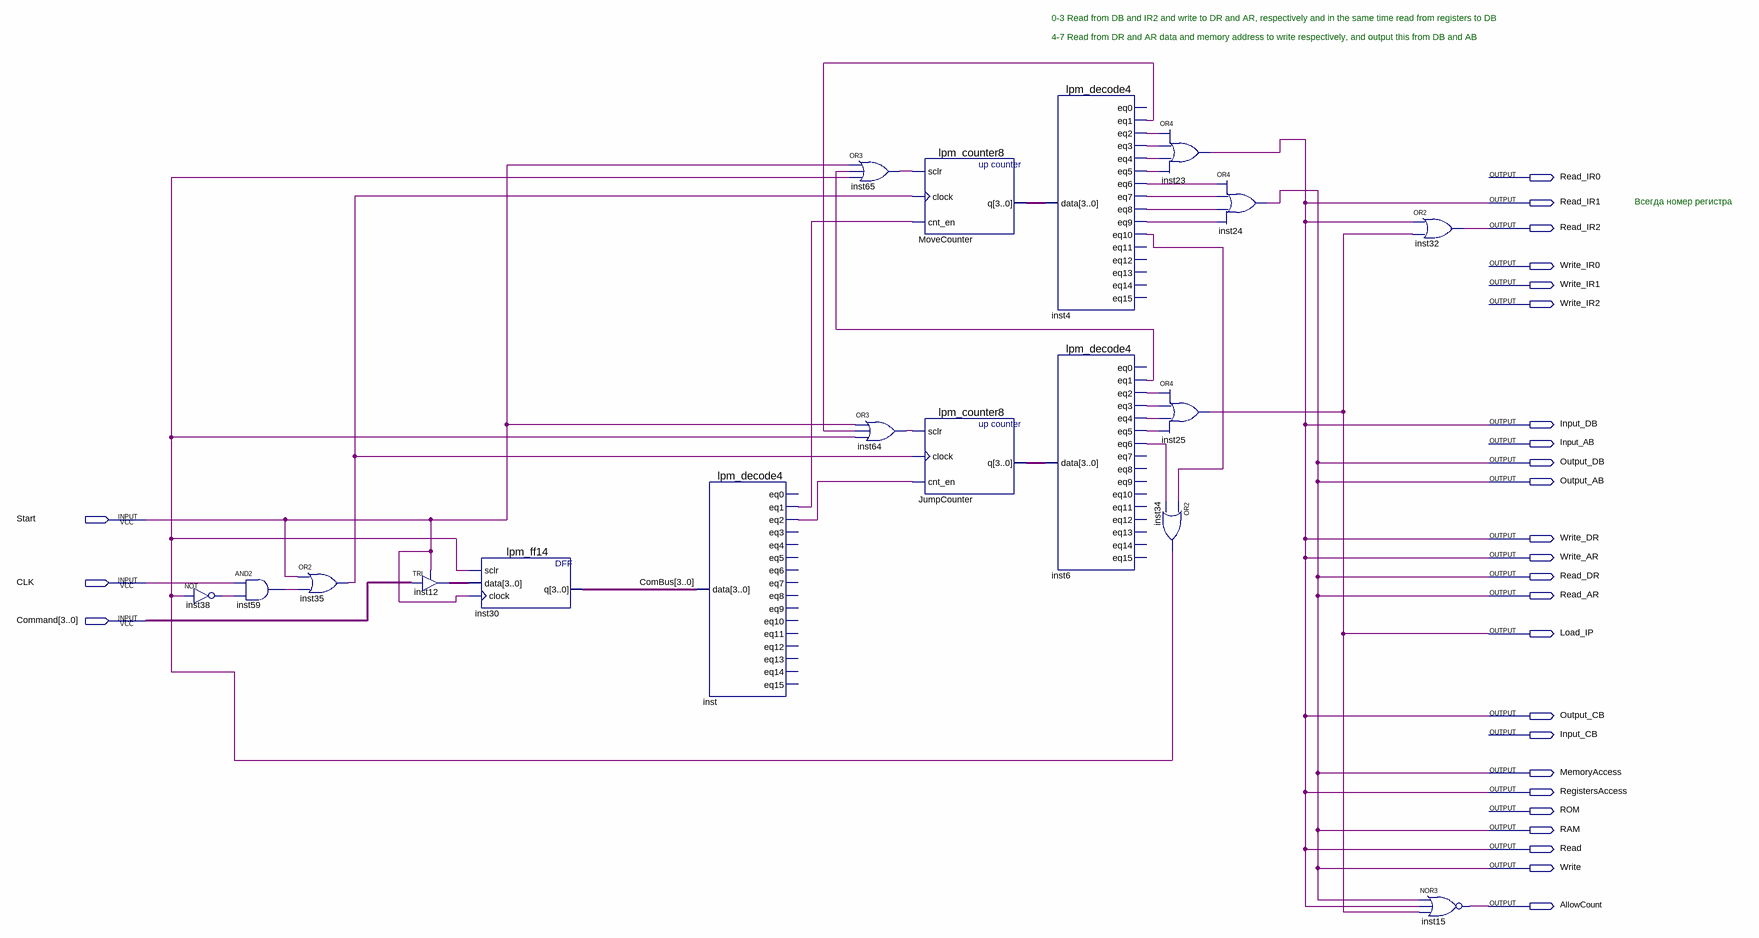
[diagram p0: schematic sheet]
// Quartus schematic CommandControl.bdf as structural Verilog: 18 symbols, 27 pins
module CommandControl (
  input  Start,
  input  CLK,
  input  [3:0] Command,
  output Read_IR0,
  output Read_IR1,
  output Read_IR2,
  output Write_IR0,
  output Write_IR1,
  output Write_IR2,
  output Input_DB,
  output Input_AB,
  output Output_DB,
  output Output_AB,
  output Write_DR,
  output Write_AR,
  output Read_DR,
  output Read_AR,
  output Load_IP,
  output Output_CB,
  output Input_CB,
  output MemoryAccess,
  output RegistersAccess,
  output ROM,
  output RAM,
  output Read,
  output Write,
  output AllowCount
);

  wire inst4_eq1, inst4_eq2, inst4_eq3, inst4_eq4, inst4_eq5, inst4_eq6, inst4_eq7, inst4_eq8, inst4_eq9,
       inst4_eq10, inst6_eq1, inst6_eq2, inst6_eq3, inst6_eq4, inst6_eq5, inst6_eq6, inst34_out, inst35_out,
       inst38_out, inst59_out, inst64_out, inst65_out, inst_eq1, inst_eq2;
  wire [3:0] ComBus, inst12_out, JumpCounter_q, MoveCounter_q;

  not inst38 (inst38_out, inst34_out);
  and inst59 (inst59_out, CLK, inst38_out);
  or inst35 (inst35_out, Start, inst59_out);
  TRI inst12[3:0] (.IN(Command), .OE(Start), .OUT(inst12_out));
  lpm_ff14 inst30 (.sclr(inst34_out), .data(inst12_out), .clock(Start), .q(ComBus));
  lpm_decode4 inst (
    .data(ComBus), .eq1(inst_eq1), .eq2(inst_eq2));  // open: eq0, eq3, eq4, eq5, eq6, eq7, eq8, eq9, eq10, eq11, eq12, eq13, eq14, eq15
  or inst65 (inst65_out, Start, inst6_eq1, inst34_out);
  or inst64 (inst64_out, Start, inst4_eq1, inst34_out);
  lpm_counter8 MoveCounter (.sclr(inst65_out), .clock(inst35_out), .cnt_en(inst_eq1), .q(MoveCounter_q));
  lpm_counter8 JumpCounter (.sclr(inst64_out), .clock(inst35_out), .cnt_en(inst_eq2), .q(JumpCounter_q));
  lpm_decode4 inst4 (
    .data(MoveCounter_q), .eq1(inst4_eq1), .eq2(inst4_eq2), .eq3(inst4_eq3), .eq4(inst4_eq4),
    .eq5(inst4_eq5), .eq6(inst4_eq6), .eq7(inst4_eq7), .eq8(inst4_eq8), .eq9(inst4_eq9), .eq10(inst4_eq10));  // open: eq0, eq11, eq12, eq13, eq14, eq15
  lpm_decode4 inst6 (
    .data(JumpCounter_q), .eq1(inst6_eq1), .eq2(inst6_eq2), .eq3(inst6_eq3), .eq4(inst6_eq4),
    .eq5(inst6_eq5), .eq6(inst6_eq6));  // open: eq0, eq7, eq8, eq9, eq10, eq11, eq12, eq13, eq14, eq15
  or inst23 (Input_DB, inst4_eq2, inst4_eq3, inst4_eq4, inst4_eq5);
  or inst25 (Load_IP, inst6_eq2, inst6_eq3, inst6_eq4, inst6_eq5);
  or inst34 (inst34_out, inst4_eq10, inst6_eq6);
  or inst24 (MemoryAccess, inst4_eq6, inst4_eq7, inst4_eq8, inst4_eq9);
  or inst32 (Read_IR2, Input_DB, Load_IP);
  nor inst15 (AllowCount, MemoryAccess, Input_DB, Load_IP);

  assign Output_AB = MemoryAccess;
  assign Output_CB = Input_DB;
  assign Output_DB = MemoryAccess;
  assign RAM = MemoryAccess;
  assign Read = Input_DB;
  assign Read_AR = MemoryAccess;
  assign Read_DR = MemoryAccess;
  assign Read_IR1 = Input_DB;
  assign RegistersAccess = Input_DB;
  assign Write = MemoryAccess;
  assign Write_AR = Input_DB;
  assign Write_DR = Input_DB;

  // Notes on the sheet:
  //   0-3 Read from DB and IR2 and write to DR and AR, respectively and in the same time read from registers to DB
  //   4-7 Read from DR and AR data and memory address to write respectively, and output this from DB and AB
  //   Всегда номер регистра
endmodule
